# EAGLE design CameraBoard (EAGLE 9.4.1)
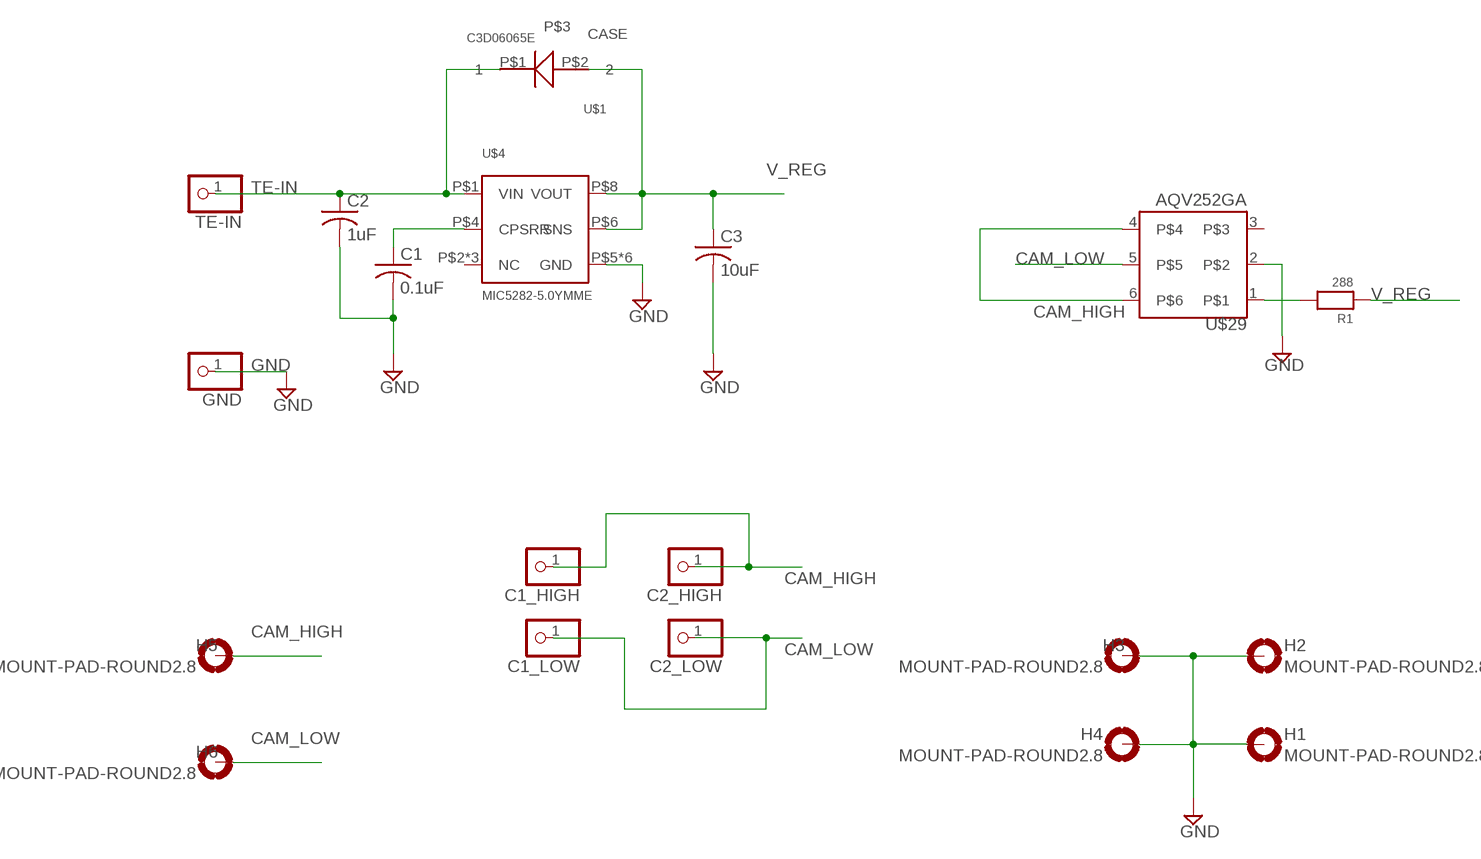
[diagram p0: schematic, sheet 1]

## Parts
C1  0.1uF  C-USC2220K  [C2220K]
C1_HIGH  PINHD-1X1  [1X01]
C1_LOW  PINHD-1X1  [1X01]
C2  1uF  C-USC2220K  [C2220K]
C2_HIGH  PINHD-1X1  [1X01]
C2_LOW  PINHD-1X1  [1X01]
C3  10uF  C-USC2220K  [C2220K]
GND  PINHD-1X1  [1X01]
H1  MOUNT-PAD-ROUND2.8  [2,8-PAD]
H2  MOUNT-PAD-ROUND2.8  [2,8-PAD]
H3  MOUNT-PAD-ROUND2.8  [2,8-PAD]
H4  MOUNT-PAD-ROUND2.8  [2,8-PAD]
H5  MOUNT-PAD-ROUND2.8  [2,8-PAD]
H6  MOUNT-PAD-ROUND2.8  [2,8-PAD]
R1  288  RESISTOR_0805  [_0805]
TE-IN  PINHD-1X1  [1X01]
U$1  C3D06065E  [TO-252]
U$4  MIC5282-5.0YMME  [MSOP8-EPAD]
U$29  AQV252GA  [DIP6]

## Nets
CAM_HIGH: C1_HIGH.1 C2_HIGH.1 H5.B2,8(MOUNT) U$29.4 U$29.6
CAM_LOW: C1_LOW.1 C2_LOW.1 H6.B2,8(MOUNT) U$29.5
GND: C1.2 C2.2 C3.2 GND.1 H1.B2,8(MOUNT) H2.B2,8(MOUNT) H3.B2,8(MOUNT) H4.B2,8(MOUNT) U$4.P$5(GND) U$4.P$9(GND) U$4.P$10(GND) U$4.P$11(GND) U$4.P$12(GND) U$4.P$13(GND) U$29.2
N$3: C1.1 U$4.P$4(CPSRR)
N$4: R1.2 U$29.1
TE-IN: C2.1 TE-IN.1 U$1.P$1 U$4.P$1(VIN)
V_REG: C3.1 R1.1 U$1.P$2 U$4.P$6(SNS) U$4.P$8(VOUT)
Unconnected: U$1.P$3(CASE) U$4.P$2(NC) U$4.P$3(NC) U$4.P$7(NC) U$29.3

## Library data of the parts
C1-C3 = adafruit:C-US: CAPACITOR, American symbol
C1_HIGH C1_LOW C2_HIGH C2_LOW GND TE-IN = adafruit:PINHD-1X1: Pin header 1x1 for 0.1" spacing With round pins
H1-H6 = holes:MOUNT-PAD-ROUND: MOUNTING PAD, round
R1 = microbuilder:RESISTOR: Resistors 0402 - 0402 Surface Mount Package 22 Ohm 1% 1/16W [Digikey: 311-22.0LRTR-ND] 33 Ohm 5% 1/16W 1.0K 5% 1/16W 1.5K 5% 1/16W 2.0K 1% 1/16W 10.0K 1% 1/16W [Digikey: 311-10.0KLRTR-ND] 10.0K 5% 1/16W [Digikey: RMCF0402JT10K0TR-ND] 12.1K 1% 1/16W [Digikey: 311-22.0LRTR-ND] 100.0K 5% 1/16W 0603 - 0603 Surface Mount Package 0 Ohm 1/10 Watt 1% Resistor 15 Ohm 1/10 Watt 1% Resistor 33 Ohm 1/10 Watt 1% Resistor 49.9 Ohm 1/10 Watt 1% Resistor 100 Ohm 1/10 Watt 1% Resistor 150 Ohm 1/10 Watt 1% Resistor 240 Ohm 1/10 Watt 1% Resistor 390 Ohm 1/10 Watt 1% Resistor 560 Ohm 1/10 Watt 1% Resistor 680 Ohm 1/10 Watt 1% Resistor 750 Ohm 1/10 Watt 1% Resistor 1.0K Ohm 1/10 Watt 1% Resistor 1.5K Ohm 1/10 Watt 1% Resistor 2.0K Ohm 1/10 Watt 1% Resistor 2.2K Ohm 1/10 Watt 1% Resistor 3.3K Ohm 1/10 Watt 1% Resistor 4.7K Ohm 1/10 Watt 1% Resistor 10.0K Ohm 1/10 Watt 1% Resistor 12.0K Ohm 1/10 Watt 1% Resistor 12.1K Ohm 1/10 Watt 1% Resistor 20.0K Ohm 1/10 Watt 1% Resistor 33.0K Ohm 1/10 Watt 1% Resistor 100.0K Ohm 1/10 Watt 1% Resistor 0805 - 0805 Surface Mount Package 0 Ohm 1/8 Watt 1% Resistor 33 Ohm 1/8 Watt 1% Resistor 100 Ohm 1/8 Watt 1% Resistor 150 Ohm 1/8 Watt 1% Resistor 200 Ohm 1/8 Watt 1% Resistor 240 Ohm 1/8 Watt 1% Resistor 330 Ohm 1/8 Watt 1% Resistor 390 Ohm 1/8 Watt 1% Resistor 470 Ohm 1/8 Watt 1% Resistor 1.0K Ohm 1/8 Watt 1% Resistor 1.5K Ohm 1/8 Watt 1% Resistor 2.0K Ohm 1/8 Watt 1% Resistor 4.7K Ohm 1/8 Watt 1% Resistor 5.1K Ohm 1/8 Watt 1% Resistor 5.6K Ohm 1/8 Watt 1% Resistor 10.0K Ohm 1/8 Watt 1% Resistor 22.0K Ohm 1/8 Watt 1% Resistor 33.0K Ohm 1/8 Watt 1% Resistor 100K Ohm 1/8 Watt 1% Resistor 1206 - 1206 Surface Mount Package 2012 - 2010 Surface Mount Package 0.11 Ohm 1/2 Watt 1% Resistor - Digikey: RHM.11UCT-ND
U$1 = TI_radio:C3D06065E
U$4 = TI_radio:MIC5282-5.0YMME
U$29 = TI_radio:AQV252GA

## Board
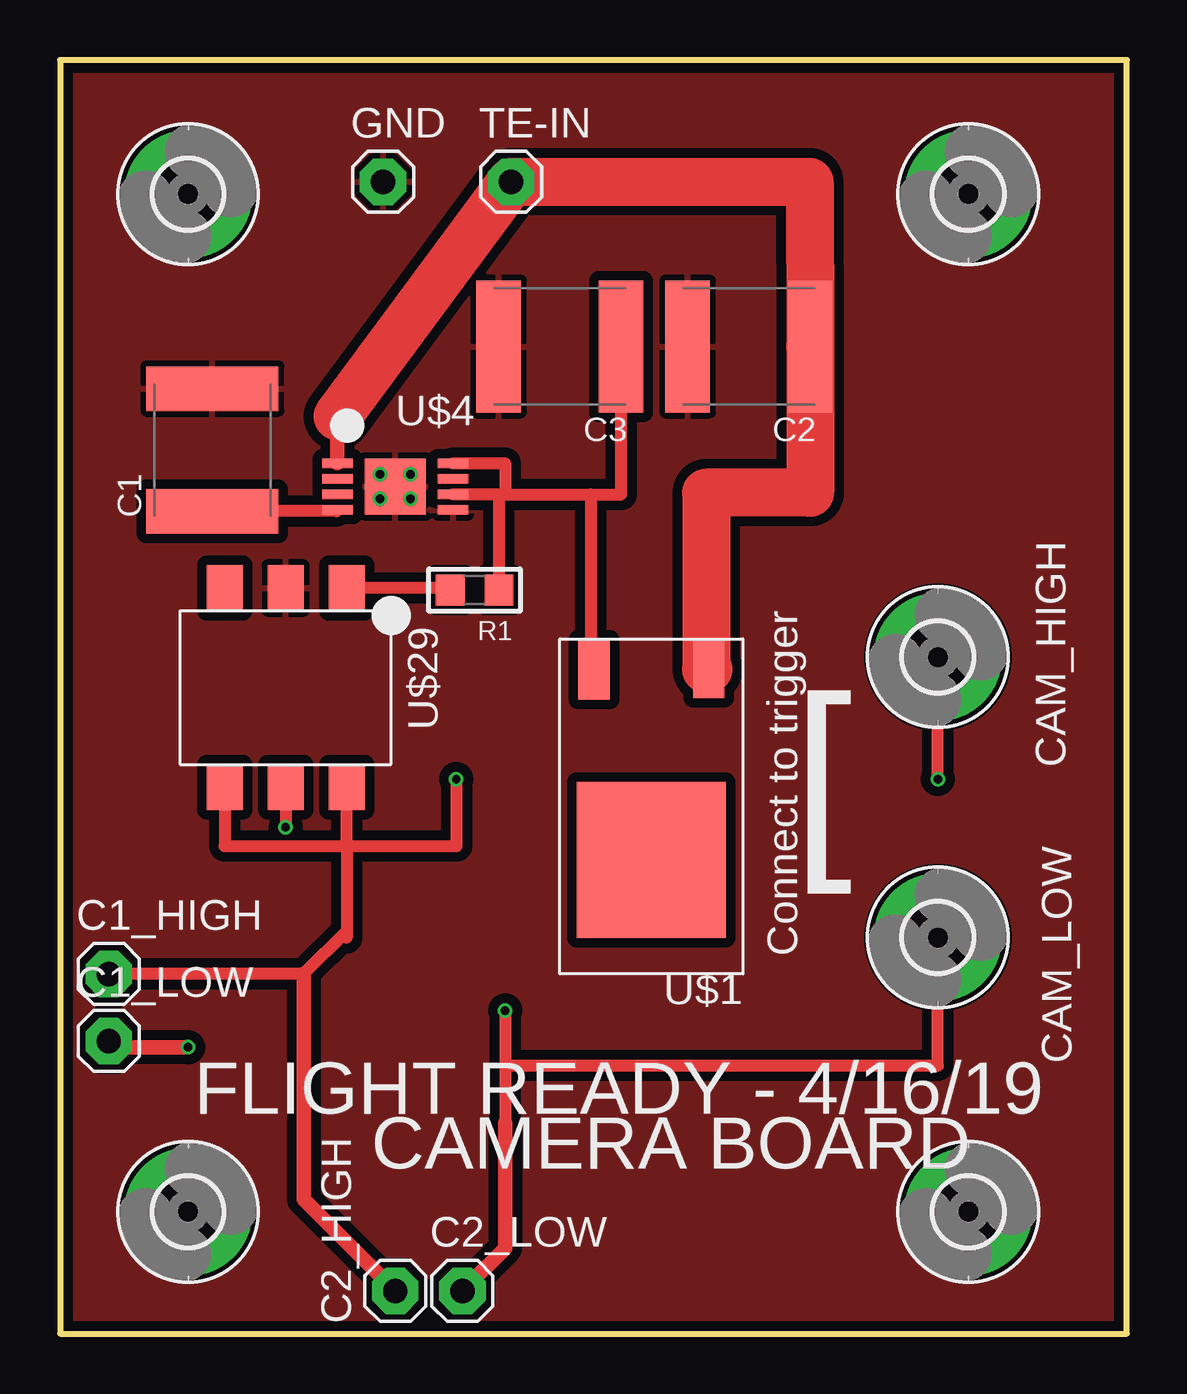
[diagram p1: board, top side]
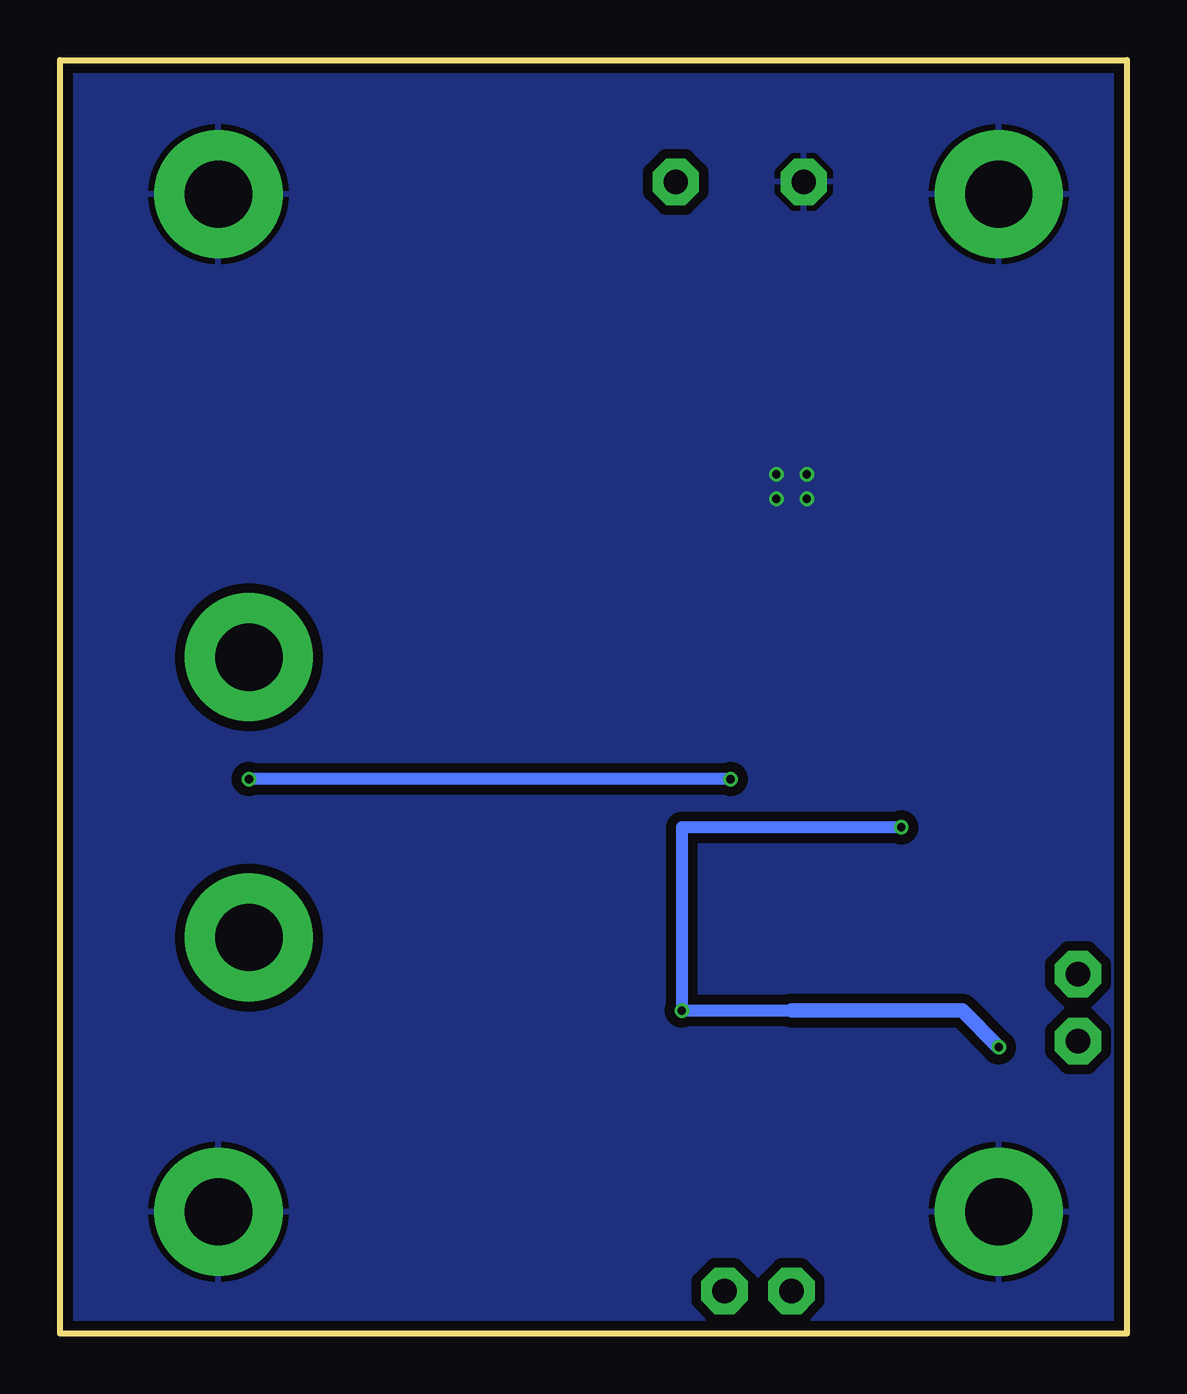
[diagram p2: board, bottom side, seen from below]

Size 44.45 x 53.09 mm. Coordinates in mm from the lower left corner, seen from the top.
Outline: 0,53.09 0,0 44.45,0 44.45,53.09 0,53.09
Copper layers (1*16): Top 0.035559375mm / dielectric 1.6mm / Bottom 0.035559375mm
Design rules "oshpark-2layer": minimum track width 6mil, minimum drill 10mil, track to track 6mil, track to pad 6mil, pad to pad 6mil, via to via 6mil, smd to smd 6mil, copper to edge 15mil, drill to drill 6mil, minimum pad ring 5mil, minimum via ring 5mil, stop-mask expansion 2.5mil, vias tented up to drill 0mil, thermal gap 10mil

### Footprints (pad centres in the part's own frame; a part is rotated, then mirrored left to right if it is on the bottom)
C2220K = smd 1.85 x 5.5: 1 -2.55,0; 2 2.55,0
1X01 = drill 1.016 pad 1.93 octagon: 1 0,0
2,8-PAD = drill 2.8 pad 5.334: B2,8 0,0
_0805 = smd 1.2 x 1.3: 1 -1.016,0; 2 1.016,0
TO-252 = smd 1.3 x 2.4: P$1 -2.39,0 | smd 1.3 x 2.5: P$2 2.39,0 | smd 6.2 x 6.5: P$3 0,7.95
MSOP8-EPAD = smd 1.26 x 0.4: P$1 -2.405,0.975; P$2 -2.405,0.325; P$3 -2.405,-0.325; P$4 -2.405,-0.975; P$5 2.405,-0.975; P$6 2.405,-0.325; P$7 2.405,0.325; P$8 2.405,0.975 | smd 2.55 x 2.35: P$9 0,0 | drill 0.35: P$10 -0.635,0.508; P$11 0.635,0.508; P$12 0.635,-0.508; P$13 -0.635,-0.508
DIP6 = smd 1.9 x 1.5: 1 -4.15,2.54; 2 -4.15,0; 3 -4.15,-2.54; 4 4.15,-2.54; 5 4.15,0; 6 4.15,2.54

### Placement (x,y rotation side)
C1  6.35,36.83 90 top
C1_HIGH  2.03,14.99 0 top
C1_LOW  2.03,12.19 0 top
C2  28.7,41.15 180 top
C2_HIGH  13.97,1.78 90 top
C2_LOW  16.76,1.78 0 top
C3  20.83,41.15 180 top
GND  13.46,48.01 0 top
H1  37.85,5.08 0 top
H2  5.33,5.08 0 top
H3  5.33,47.5 0 top
H4  37.85,47.5 0 top
H5  36.58,28.19 0 top
H6  36.58,16.51 0 top
R1  17.27,30.99 180 top
TE-IN  18.8,48.01 0 top
U$1  24.64,27.69 180 top
U$4  13.97,35.31 0 top
U$29  9.4,26.92 270 top

### Tracks (layer width: path | path; a pad name or v marks a point on that pad's centre or on a via)
CAM_HIGH  (via drill 0.35)
  Top 0.508: U$29.4 6.86,20.32 11.94,20.32 | 11.94,20.32 U$29.6 | 11.94,20.32 16.53,20.32 16.53,23.11 v16.51,23.11 | 11.94,20.32 11.94,16.76 | 11.94,16.76 11.94,16.49 | v36.58,23.11 H5.B2,8 | 11.94,16.76 10.16,14.99 C1_HIGH.1
  Top 0.61: 10.16,14.99 10.16,5.59 C2_HIGH.1
  Bottom 0.508: v16.51,23.11 v36.58,23.11
CAM_LOW  (via drill 0.35)
  Top 0.508: H6.B2,8 36.58,11.18 18.54,11.18 v18.54,13.46 18.54,8.78 | U$29.5 v9.4,21.11
  Top 0.61: 18.54,8.78 18.54,3.56 C2_LOW.1 | v5.33,11.94 2.29,11.94 C1_LOW.1
  Bottom 0.508: v9.4,21.11 18.54,21.11 v18.54,13.46 13.97,13.46
  Bottom 0.61: 13.97,13.46 6.86,13.46 v5.33,11.94
GND
  pour Top (isolate 0.406): -3.56,54.1 47.24,54.1 47.24,-3.05 -3.56,-3.05
  pour Bottom (isolate 0.406): -3.56,54.1 46.99,54.1 46.99,-3.05 -3.56,-3.05
N$3
  Top 0.152: U$4.P$4 11.51,34.28
  Top 0.508: 11.51,34.28 C1.1
N$4
  Top 0.508: 16.25,31.07 U$29.1
  Top 0.61: R1.2 16.25,31.07
TE-IN
  Top 0.508: 11.56,36.29 U$4.P$1
  Top 0.61: 11.56,38.23 11.56,36.29
  Top 2: 11.56,38.23 TE-IN.1 31.24,48.01 C2.1 31.25,35.05 26.92,35.05 26.92,27.69 U$1.P$1
V_REG
  Top 0.508: U$4.P$8 18.54,36.28 18.54,34.98 | 18.29,34.98 U$4.P$6 | 18.54,34.98 22.11,34.98 | 22.11,34.98 22.11,27.83 | 18.54,34.98 18.29,34.98 | 18.29,34.98 R1.1 | C3.1 23.38,34.98 22.11,34.98
  Top 0.813: 22.11,27.83 U$1.P$2

### Text on the board
tPlace: FLIGHT READY - 4/16/19 | CAMERA BOARD
tNames: [ | CAM_HIGH | CAM_LOW | Connect to trigger